# EasyEDA schematic SCH_Keyboard_2024-06-21.json
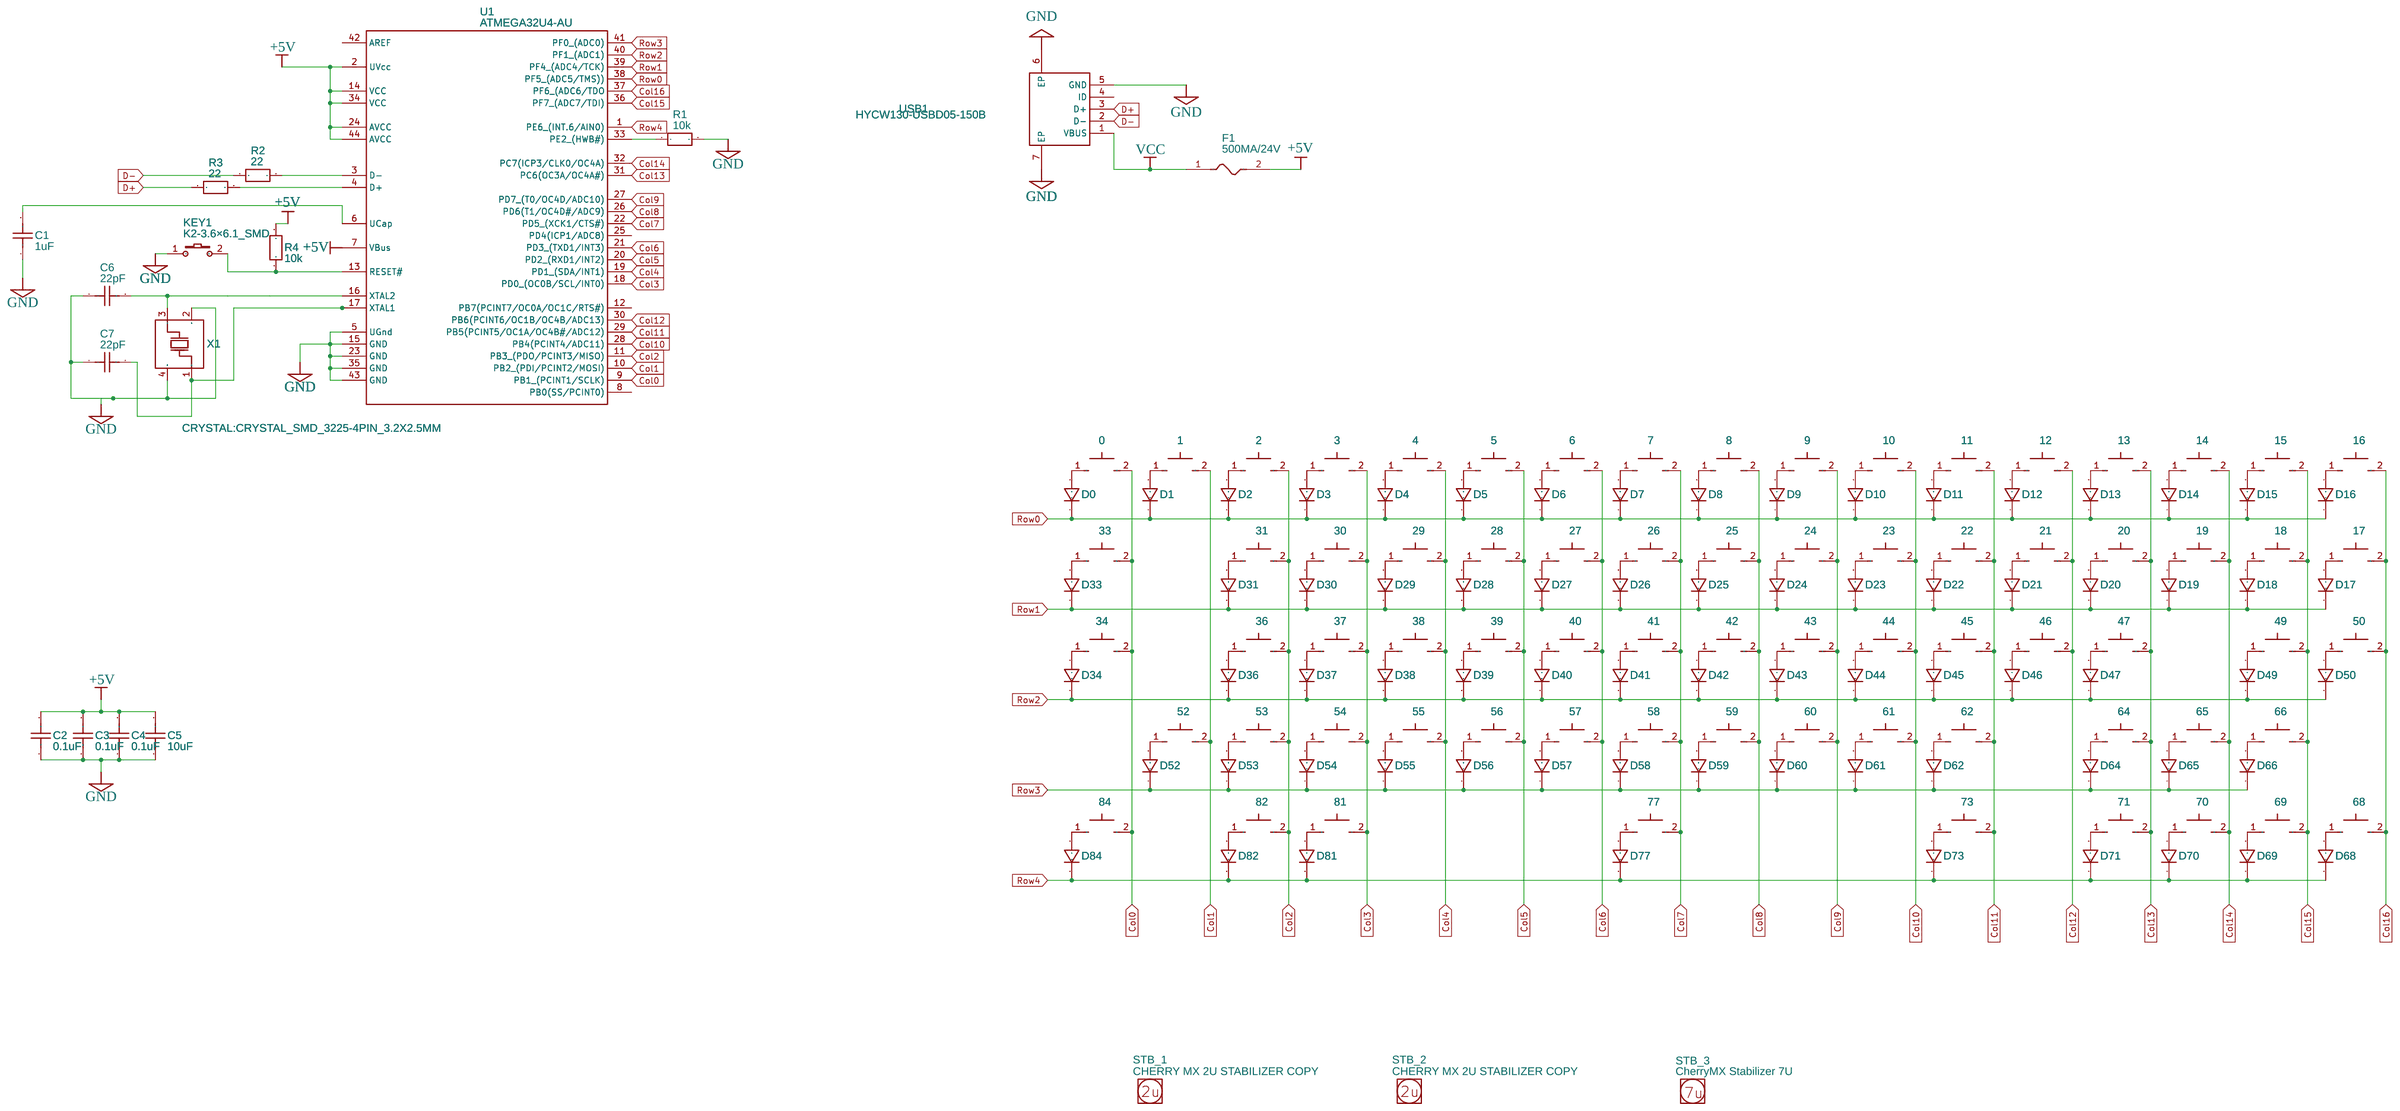
[diagram p0: schematic sheet]

## Parts
0  CPG151101S11-16  [MX1A-SKCM HYBRID]
1  CPG151101S11-16  [MX1A-SKCM HYBRID]
2  CPG151101S11-16  [MX1A-SKCM HYBRID]
3  CPG151101S11-16  [MX1A-SKCM HYBRID]
4  CPG151101S11-16  [MX1A-SKCM HYBRID]
5  CPG151101S11-16  [MX1A-SKCM HYBRID]
6  CPG151101S11-16  [MX1A-SKCM HYBRID]
7  CPG151101S11-16  [MX1A-SKCM HYBRID]
8  CPG151101S11-16  [MX1A-SKCM HYBRID]
9  CPG151101S11-16  [MX1A-SKCM HYBRID]
10  CPG151101S11-16  [MX1A-SKCM HYBRID]
11  CPG151101S11-16  [MX1A-SKCM HYBRID]
12  CPG151101S11-16  [MX1A-SKCM HYBRID]
13  CPG151101S11-16  [MX1A-SKCM HYBRID]
14  CPG151101S11-16  [MX1A-SKCM HYBRID]
15  CPG151101S11-16  [MX1A-SKCM HYBRID]
16  CPG151101S11-16  [MX1A-SKCM HYBRID]
17  CPG151101S11-16  [MX1A-SKCM HYBRID]
18  CPG151101S11-16  [MX1A-SKCM HYBRID]
19  CPG151101S11-16  [MX1A-SKCM HYBRID]
20  CPG151101S11-16  [MX1A-SKCM HYBRID]
21  CPG151101S11-16  [MX1A-SKCM HYBRID]
22  CPG151101S11-16  [MX1A-SKCM HYBRID]
23  CPG151101S11-16  [MX1A-SKCM HYBRID]
24  CPG151101S11-16  [MX1A-SKCM HYBRID]
25  CPG151101S11-16  [MX1A-SKCM HYBRID]
26  CPG151101S11-16  [MX1A-SKCM HYBRID]
27  CPG151101S11-16  [MX1A-SKCM HYBRID]
28  CPG151101S11-16  [MX1A-SKCM HYBRID]
29  CPG151101S11-16  [MX1A-SKCM HYBRID]
30  CPG151101S11-16  [MX1A-SKCM HYBRID]
31  CPG151101S11-16  [MX1A-SKCM HYBRID]
33  CPG151101S11-16  [MX1A-SKCM HYBRID]
34  CPG151101S11-16  [MX1A-SKCM HYBRID]
36  CPG151101S11-16  [MX1A-SKCM HYBRID]
37  CPG151101S11-16  [MX1A-SKCM HYBRID]
38  CPG151101S11-16  [MX1A-SKCM HYBRID]
39  CPG151101S11-16  [MX1A-SKCM HYBRID]
40  CPG151101S11-16  [MX1A-SKCM HYBRID]
41  CPG151101S11-16  [MX1A-SKCM HYBRID]
42  CPG151101S11-16  [MX1A-SKCM HYBRID]
43  CPG151101S11-16  [MX1A-SKCM HYBRID]
44  CPG151101S11-16  [MX1A-SKCM HYBRID]
45  CPG151101S11-16  [MX1A-SKCM HYBRID]
46  CPG151101S11-16  [MX1A-SKCM HYBRID]
47  CPG151101S11-16  [MX1A-SKCM HYBRID]
49  CPG151101S11-16  [MX1A-SKCM HYBRID]
50  CPG151101S11-16  [MX1A-SKCM HYBRID]
52  CPG151101S11-16  [MX1A-SKCM HYBRID]
53  CPG151101S11-16  [MX1A-SKCM HYBRID]
54  CPG151101S11-16  [MX1A-SKCM HYBRID]
55  CPG151101S11-16  [MX1A-SKCM HYBRID]
56  CPG151101S11-16  [MX1A-SKCM HYBRID]
57  CPG151101S11-16  [MX1A-SKCM HYBRID]
58  CPG151101S11-16  [MX1A-SKCM HYBRID]
59  CPG151101S11-16  [MX1A-SKCM HYBRID]
60  CPG151101S11-16  [MX1A-SKCM HYBRID]
61  CPG151101S11-16  [MX1A-SKCM HYBRID]
62  CPG151101S11-16  [MX1A-SKCM HYBRID]
64  CPG151101S11-16  [MX1A-SKCM HYBRID]
65  CPG151101S11-16  [MX1A-SKCM HYBRID]
66  CPG151101S11-16  [MX1A-SKCM HYBRID]
68  CPG151101S11-16  [MX1A-SKCM HYBRID]
69  CPG151101S11-16  [MX1A-SKCM HYBRID]
70  CPG151101S11-16  [MX1A-SKCM HYBRID]
71  CPG151101S11-16  [MX1A-SKCM HYBRID]
73  CPG151101S11-16  [MX1A-SKCM HYBRID]
77  CPG151101S11-16  [MX1A-SKCM HYBRID]
81  CPG151101S11-16  [MX1A-SKCM HYBRID]
82  CPG151101S11-16  [MX1A-SKCM HYBRID]
84  CPG151101S11-16  [MX1A-SKCM HYBRID]
C1  1uF  [C0603]
C2  0.1uF  [C0603]
C3  0.1uF  [C0603]
C4  0.1uF  [C0603]
C5  10uF  [C0603]
C6  22pF  [C0603]
C7  22pF  [C0603]
D0  1N4007W  [SOD-123_L2.8-W1.8-LS3.7-RD]
D1  1N4007W  [SOD-123_L2.8-W1.8-LS3.7-RD]
D2  1N4007W  [SOD-123_L2.8-W1.8-LS3.7-RD]
D3  1N4007W  [SOD-123_L2.8-W1.8-LS3.7-RD]
D4  1N4007W  [SOD-123_L2.8-W1.8-LS3.7-RD]
D5  1N4007W  [SOD-123_L2.8-W1.8-LS3.7-RD]
D6  1N4007W  [SOD-123_L2.8-W1.8-LS3.7-RD]
D7  1N4007W  [SOD-123_L2.8-W1.8-LS3.7-RD]
D8  1N4007W  [SOD-123_L2.8-W1.8-LS3.7-RD]
D9  1N4007W  [SOD-123_L2.8-W1.8-LS3.7-RD]
D10  1N4007W  [SOD-123_L2.8-W1.8-LS3.7-RD]
D11  1N4007W  [SOD-123_L2.8-W1.8-LS3.7-RD]
D12  1N4007W  [SOD-123_L2.8-W1.8-LS3.7-RD]
D13  1N4007W  [SOD-123_L2.8-W1.8-LS3.7-RD]
D14  1N4007W  [SOD-123_L2.8-W1.8-LS3.7-RD]
D15  1N4007W  [SOD-123_L2.8-W1.8-LS3.7-RD]
D16  1N4007W  [SOD-123_L2.8-W1.8-LS3.7-RD]
D17  1N4007W  [SOD-123_L2.8-W1.8-LS3.7-RD]
D18  1N4007W  [SOD-123_L2.8-W1.8-LS3.7-RD]
D19  1N4007W  [SOD-123_L2.8-W1.8-LS3.7-RD]
D20  1N4007W  [SOD-123_L2.8-W1.8-LS3.7-RD]
D21  1N4007W  [SOD-123_L2.8-W1.8-LS3.7-RD]
D22  1N4007W  [SOD-123_L2.8-W1.8-LS3.7-RD]
D23  1N4007W  [SOD-123_L2.8-W1.8-LS3.7-RD]
D24  1N4007W  [SOD-123_L2.8-W1.8-LS3.7-RD]
D25  1N4007W  [SOD-123_L2.8-W1.8-LS3.7-RD]
D26  1N4007W  [SOD-123_L2.8-W1.8-LS3.7-RD]
D27  1N4007W  [SOD-123_L2.8-W1.8-LS3.7-RD]
D28  1N4007W  [SOD-123_L2.8-W1.8-LS3.7-RD]
D29  1N4007W  [SOD-123_L2.8-W1.8-LS3.7-RD]
D30  1N4007W  [SOD-123_L2.8-W1.8-LS3.7-RD]
D31  1N4007W  [SOD-123_L2.8-W1.8-LS3.7-RD]
D33  1N4007W  [SOD-123_L2.8-W1.8-LS3.7-RD]
D34  1N4007W  [SOD-123_L2.8-W1.8-LS3.7-RD]
D36  1N4007W  [SOD-123_L2.8-W1.8-LS3.7-RD]
D37  1N4007W  [SOD-123_L2.8-W1.8-LS3.7-RD]
D38  1N4007W  [SOD-123_L2.8-W1.8-LS3.7-RD]
D39  1N4007W  [SOD-123_L2.8-W1.8-LS3.7-RD]
D40  1N4007W  [SOD-123_L2.8-W1.8-LS3.7-RD]
D41  1N4007W  [SOD-123_L2.8-W1.8-LS3.7-RD]
D42  1N4007W  [SOD-123_L2.8-W1.8-LS3.7-RD]
D43  1N4007W  [SOD-123_L2.8-W1.8-LS3.7-RD]
D44  1N4007W  [SOD-123_L2.8-W1.8-LS3.7-RD]
D45  1N4007W  [SOD-123_L2.8-W1.8-LS3.7-RD]
D46  1N4007W  [SOD-123_L2.8-W1.8-LS3.7-RD]
D47  1N4007W  [SOD-123_L2.8-W1.8-LS3.7-RD]
D49  1N4007W  [SOD-123_L2.8-W1.8-LS3.7-RD]
D50  1N4007W  [SOD-123_L2.8-W1.8-LS3.7-RD]
D52  1N4007W  [SOD-123_L2.8-W1.8-LS3.7-RD]
D53  1N4007W  [SOD-123_L2.8-W1.8-LS3.7-RD]
D54  1N4007W  [SOD-123_L2.8-W1.8-LS3.7-RD]
D55  1N4007W  [SOD-123_L2.8-W1.8-LS3.7-RD]
D56  1N4007W  [SOD-123_L2.8-W1.8-LS3.7-RD]
D57  1N4007W  [SOD-123_L2.8-W1.8-LS3.7-RD]
D58  1N4007W  [SOD-123_L2.8-W1.8-LS3.7-RD]
D59  1N4007W  [SOD-123_L2.8-W1.8-LS3.7-RD]
D60  1N4007W  [SOD-123_L2.8-W1.8-LS3.7-RD]
D61  1N4007W  [SOD-123_L2.8-W1.8-LS3.7-RD]
D62  1N4007W  [SOD-123_L2.8-W1.8-LS3.7-RD]
D64  1N4007W  [SOD-123_L2.8-W1.8-LS3.7-RD]
D65  1N4007W  [SOD-123_L2.8-W1.8-LS3.7-RD]
D66  1N4007W  [SOD-123_L2.8-W1.8-LS3.7-RD]
D68  1N4007W  [SOD-123_L2.8-W1.8-LS3.7-RD]
D69  1N4007W  [SOD-123_L2.8-W1.8-LS3.7-RD]
D70  1N4007W  [SOD-123_L2.8-W1.8-LS3.7-RD]
D71  1N4007W  [SOD-123_L2.8-W1.8-LS3.7-RD]
D73  1N4007W  [SOD-123_L2.8-W1.8-LS3.7-RD]
D77  1N4007W  [SOD-123_L2.8-W1.8-LS3.7-RD]
D81  1N4007W  [SOD-123_L2.8-W1.8-LS3.7-RD]
D82  1N4007W  [SOD-123_L2.8-W1.8-LS3.7-RD]
D84  1N4007W  [SOD-123_L2.8-W1.8-LS3.7-RD]
F1  500MA/24V  [F1206]
KEY1  K2-3.6×6.1_SMD  [KEY-SMD_2P-L6.2-W3.6-LS8.0]
R1  10k  [R0603]
R2  22  [R0603]
R3  22  [R0603]
R4  10k  [R0603]
STB_1  CHERRY MX 2U STABILIZER COPY  [MX1A STABILIZER 2U]
STB_2  CHERRY MX 2U STABILIZER COPY  [MX1A STABILIZER 2U]
STB_3  CherryMX Stabilizer 7U  [CHERRYMX STABILIZER 7U]
U1  ATMEGA32U4-AU  [QFP-44_L10.0-W10.0-P0.80-LS13.2-BL]
USB1  HYCW130-USBD05-150B  [MICRO-USB-SMD_MICROQTJ]
X1  CRYSTAL:CRYSTAL_SMD_3225-4PIN_3.2X2.5MM  [CRYSTAL-SMD_4P-L2.5-W2.0-BL_XTAL12MHZ]

## Library data of the parts
0-31 33 34 36-47 49 50 52-62 64-66 68-71 73 77 81 82 84 = CPG151101S11-16: Contributor: lcsc; Supplier: LCSC; Supplier Part: C5156480; Manufacturer: Kailh(凯华); JLCPCB Part Class: Extended Part
C1-C7 = C_0603_US: Contributor: LCEDA_Lib
D0-D31 D33 D34 D36-D47 D49 D50 D52-D62 D64-D66 D68-D71 D73 D77 D81 D82 D84 = 1N4007W: Supplier: LCSC; Supplier Part: C328592; Manufacturer: BLUE ROCKET; Contributor: LCEDA_Lib
F1 = 500MA/24V: Contributor: lcsc; Supplier: LCSC; Supplier Part: C2984676; Manufacturer: DOWO(东沃); Manufacturer Part: 500mA/24V; JLCPCB Part Class: Extended Part
KEY1 = K2-3.6×6.1_SMD: Supplier Part: C118141; Supplier: LCSC; Manufacturer Part: K2-1107ST-A4SW-06; Contributor: LCEDA_Lib; 制造商: 韩国韩荣
R1-R4 = R_0603_EU: Contributor: LCEDA_Lib
STB_1 STB_2 = CHERRY MX 2U STABILIZER COPY: Manufacturer Part: G99-0742; link: http://www.mouser.com/ds/2/71/mx_cat-1079739.pdf; Supplier Part: 540-G99-0742; Supplier: Mouser
STB_3 = CherryMX Stabilizer 7U: Manufacturer Part: G99-0379; Supplier Part: 540-G99-0379; Supplier: Mouser; link: http://www.mouser.com/ds/2/71/mx_cat-1079739.pdf
U1 = ATMEGA32U4-AU: Supplier: LCSC; Manufacturer: MICROCHIP(美国微芯); Supplier Part: C44854; JLCPCB Part Class: Extended Part
USB1 = HYCW130-USBD05-150B: Contributor: lcsc; Supplier: LCSC; Supplier Part: C3034161; Manufacturer: 华宇创; JLCPCB Part Class: Extended Part
X1 = CRYSTAL:CRYSTAL_SMD_3225-4PIN_3.2X2.5MM: Contributor: lcsc; Supplier: LCSC; Supplier Part: C9900019670; Manufacturer: null; Manufacturer Part: Crystal:Crystal_SMD_3225-4Pin_3.2x2.5mm; JLCPCB Part Class: Extended Part

## Nets
+5V: C2.2 C3.2 C4.2 C5.2 F1.2 R4.2 U1.2(UVcc) U1.7(VBus) U1.14(VCC) U1.24(AVCC) U1.34(VCC) U1.44(AVCC)
GND: C1.1 C2.1 C3.1 C4.1 C5.1 C6.1 C7.1 KEY1.1 R1.2 U1.5(UGnd) U1.15(GND) U1.23(GND) U1.35(GND) U1.43(GND) USB1.5(GND) USB1.6(EP) USB1.7(EP) X1.2(GND) X1.4(GND)
VCC: F1.1 USB1.1(VBUS)
Col0: 0.2 33.2 34.2 84.2 U1.9(PB1 (PCINT1/SCLK))
Col1: 1.2 52.2 U1.10(PB2 (PDI/PCINT2/MOSI))
Col2: 2.2 31.2 36.2 53.2 82.2 U1.11(PB3 (PDO/PCINT3/MISO))
Col3: 3.2 30.2 37.2 54.2 81.2 U1.18(PD0 (OC0B/SCL/INT0))
Col4: 4.2 29.2 38.2 55.2 U1.19(PD1 (SDA/INT1))
Col5: 5.2 28.2 39.2 56.2 U1.20(PD2 (RXD1/INT2))
Col6: 6.2 27.2 40.2 57.2 U1.21(PD3 (TXD1/INT3))
Col7: 7.2 26.2 41.2 58.2 77.2 U1.22(PD5 (XCK1/CTS#))
Col8: 8.2 25.2 42.2 59.2 U1.26(PD6(T1/OC4D#/ADC9))
Col9: 9.2 24.2 43.2 60.2 U1.27(PD7 (T0/OC4D/ADC10))
Col10: 10.2 23.2 44.2 61.2 U1.28(PB4(PCINT4/ADC11))
Col11: 11.2 22.2 45.2 62.2 73.2 U1.29(PB5(PCINT5/OC1A/OC4B#/ADC12))
Col12: 12.2 21.2 46.2 U1.30(PB6(PCINT6/OC1B/OC4B/ADC13))
Col13: 13.2 20.2 47.2 64.2 71.2 U1.31(PC6(OC3A/OC4A#))
Col14: 14.2 19.2 65.2 70.2 U1.32(PC7(ICP3/CLK0/OC4A))
Col15: 15.2 18.2 49.2 66.2 69.2 U1.36(PF7 (ADC7/TDI))
Col16: 16.2 17.2 50.2 68.2 U1.37(PF6 (ADC6/TDO)
D+: R3.1 USB1.3(D+)
D-: R2.1 USB1.2(D-)
Row0: D0.1 D1.1 D2.1 D3.1 D4.1 D5.1 D6.1 D7.1 D8.1 D9.1 D10.1 D11.1 D12.1 D13.1 D14.1 D15.1 D16.1 U1.38(PF5 (ADC5/TMS)))
Row1: D17.1 D18.1 D19.1 D20.1 D21.1 D22.1 D23.1 D24.1 D25.1 D26.1 D27.1 D28.1 D29.1 D30.1 D31.1 D33.1 U1.39(PF4 (ADC4/TCK))
Row2: D34.1 D36.1 D37.1 D38.1 D39.1 D40.1 D41.1 D42.1 D43.1 D44.1 D45.1 D46.1 D47.1 D49.1 D50.1 U1.40(PF1 (ADC1))
Row3: D52.1 D53.1 D54.1 D55.1 D56.1 D57.1 D58.1 D59.1 D60.1 D61.1 D62.1 D64.1 D65.1 D66.1 U1.41(PF0 (ADC0))
Row4: D68.1 D69.1 D70.1 D71.1 D73.1 D77.1 D81.1 D82.1 D84.1 U1.1(PE6 (INT.6/AIN0))
Net-(0-1): 0.1 D0.2
Net-(1-1): 1.1 D1.2
Net-(2-1): 2.1 D2.2
Net-(3-1): 3.1 D3.2
Net-(4-1): 4.1 D4.2
Net-(5-1): 5.1 D5.2
Net-(6-1): 6.1 D6.2
Net-(7-1): 7.1 D7.2
Net-(8-1): 8.1 D8.2
Net-(9-1): 9.1 D9.2
Net-(10-1): 10.1 D10.2
Net-(11-1): 11.1 D11.2
Net-(12-1): 12.1 D12.2
Net-(13-1): 13.1 D13.2
Net-(14-1): 14.1 D14.2
Net-(15-1): 15.1 D15.2
Net-(16-1): 16.1 D16.2
Net-(17-1): 17.1 D17.2
Net-(18-1): 18.1 D18.2
Net-(19-1): 19.1 D19.2
Net-(20-1): 20.1 D20.2
Net-(21-1): 21.1 D21.2
Net-(22-1): 22.1 D22.2
Net-(23-1): 23.1 D23.2
Net-(24-1): 24.1 D24.2
Net-(25-1): 25.1 D25.2
Net-(26-1): 26.1 D26.2
Net-(27-1): 27.1 D27.2
Net-(28-1): 28.1 D28.2
Net-(29-1): 29.1 D29.2
Net-(30-1): 30.1 D30.2
Net-(31-1): 31.1 D31.2
Net-(33-1): 33.1 D33.2
Net-(34-1): 34.1 D34.2
Net-(36-1): 36.1 D36.2
Net-(37-1): 37.1 D37.2
Net-(38-1): 38.1 D38.2
Net-(39-1): 39.1 D39.2
Net-(40-1): 40.1 D40.2
Net-(41-1): 41.1 D41.2
Net-(42-1): 42.1 D42.2
Net-(43-1): 43.1 D43.2
Net-(44-1): 44.1 D44.2
Net-(45-1): 45.1 D45.2
Net-(46-1): 46.1 D46.2
Net-(47-1): 47.1 D47.2
Net-(49-1): 49.1 D49.2
Net-(50-1): 50.1 D50.2
Net-(52-1): 52.1 D52.2
Net-(53-1): 53.1 D53.2
Net-(54-1): 54.1 D54.2
Net-(55-1): 55.1 D55.2
Net-(56-1): 56.1 D56.2
Net-(57-1): 57.1 D57.2
Net-(58-1): 58.1 D58.2
Net-(59-1): 59.1 D59.2
Net-(60-1): 60.1 D60.2
Net-(61-1): 61.1 D61.2
Net-(62-1): 62.1 D62.2
Net-(64-1): 64.1 D64.2
Net-(65-1): 65.1 D65.2
Net-(66-1): 66.1 D66.2
Net-(68-1): 68.1 D68.2
Net-(69-1): 69.1 D69.2
Net-(70-1): 70.1 D70.2
Net-(71-1): 71.1 D71.2
Net-(73-1): 73.1 D73.2
Net-(77-1): 77.1 D77.2
Net-(81-1): 81.1 D81.2
Net-(82-1): 82.1 D82.2
Net-(84-1): 84.1 D84.2
Net-(C1-2): C1.2 U1.6(UCap)
Net-(C6-2): C6.2 U1.16(XTAL2) X1.3(OSC2)
Net-(C7-2): C7.2 U1.17(XTAL1) X1.1(OSC1)
Net-(KEY1-2): KEY1.2 R4.1 U1.13(RESET#)
Net-(R1-1): R1.1 U1.33(PE2 (HWB#))
Net-(R2-2): R2.2 U1.3(D-)
Net-(R3-2): R3.2 U1.4(D+)

Not connected (* = marked no-connect by the designer): U1 8(PB0(SS/PCINT0)) 12(PB7(PCINT7/OC0A/OC1C/RTS#)) 25(PD4(ICP1/ADC8)) 42(AREF); USB1 4(ID)
